# Altium project BK1096.PrjPcb
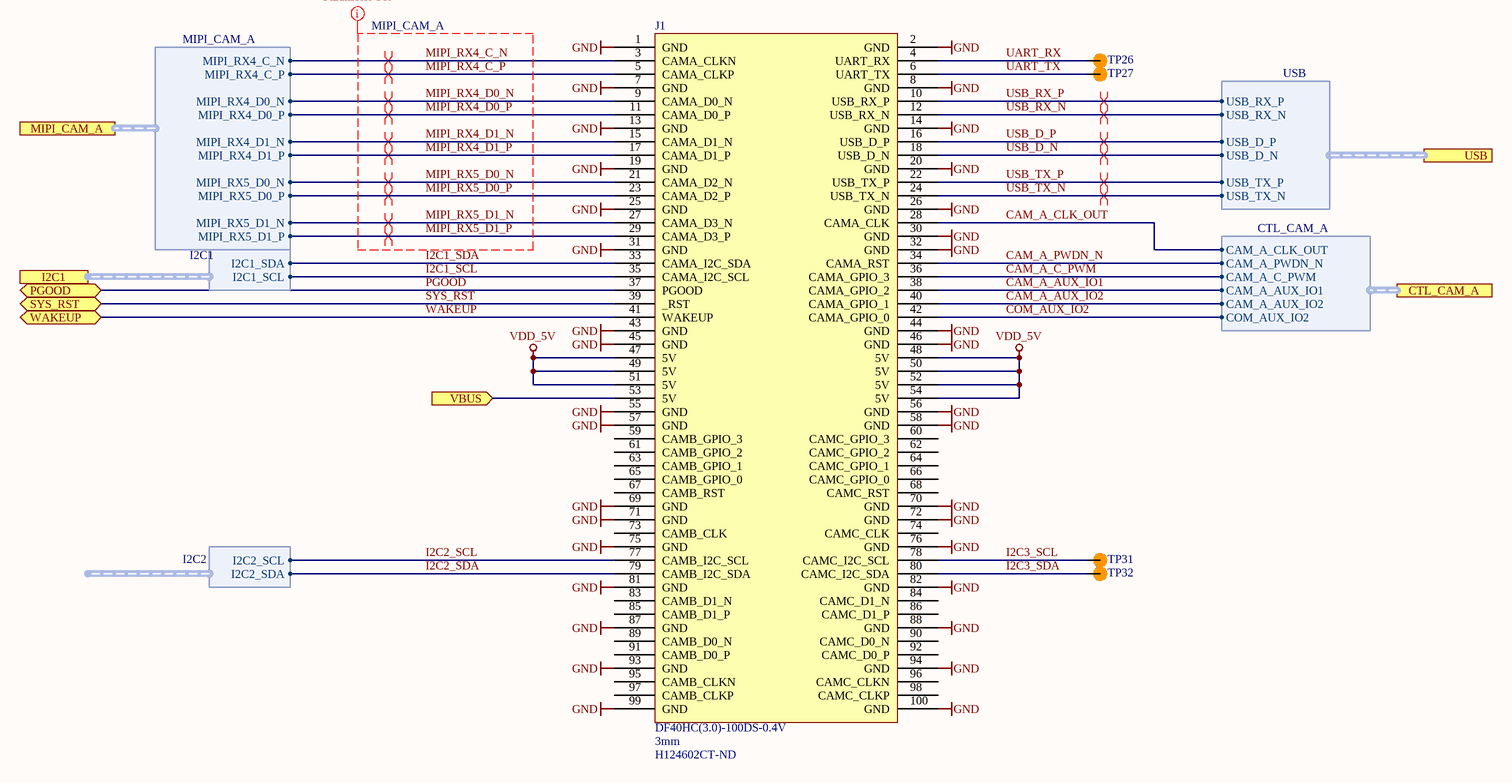
[diagram p0: BK1096_Connector.SchDoc]
document_number: D000BK1096; drawn_by: Blaž Kvas; project_title: BK1096; revision: R0M0E0
2 sheets, 37 parts. Net scope: flat (ports and power ports of the same name join across sheets).
Board file: BK1096.PcbDoc
Sheets:
  BK1096_Connector.SchDoc
  BK1096_Power_Supply.SchDoc

## Sheet BK1096_Connector.SchDoc: =project_title
size Tabloid; CompanyName: Luxonis Holding; DrawnBy: Blaž Kvas; Organization: Luxonis Holding; Address1: 1925 Harmony Park Drive; Address2: Westminster, CO; Address3: 80234; Address4: United States; DocumentNumber: D000BK1096; Revision: R0M0E0; SheetNumber: 2; SheetTotal: 5

### Parts
J1  DF40HC(3.0)-100DS-0.4V  Mated Stacking Heights: 3mm  Supplier Part Number 1: H124602CT-ND  [DF40HC-3.0-100DS-0.4V]
TP26  TP_SMD  [TP_0.75MM_SMD_NO-SILK]  (value not drawn)  (no BOM)
TP27  TP_SMD  [TP_0.75MM_SMD_NO-SILK]  (value not drawn)  (no BOM)
TP31  TP_SMD  [TP_0.75MM_SMD_NO-SILK]  (value not drawn)  (no BOM)
TP32  TP_SMD  [TP_0.75MM_SMD_NO-SILK]  (value not drawn)  (no BOM)

### Ports
CTL_CAM_A (harness CTL_CAM_A), I2C1 (harness I2C1), MIPI_CAM_A (harness MIPI_CAM_A), PGOOD (bidir), SYS_RST (bidir), USB (harness USB), VBUS (in), WAKEUP (bidir)

### Harnesses
MIPI_CAM_A: MIPI_RX4_C_P, MIPI_RX4_C_N, MIPI_RX4_D0_P, MIPI_RX4_D0_N, MIPI_RX4_D1_P, MIPI_RX4_D1_N, MIPI_RX5_D0_P, MIPI_RX5_D0_N, MIPI_RX5_D1_P, MIPI_RX5_D1_N
I2C2: I2C2_SDA, I2C2_SCL
I2C1: I2C1_SDA, I2C1_SCL
USB: USB_D_P, USB_D_N, USB_TX_N, USB_TX_P, USB_RX_N, USB_RX_P
CTL_CAM_A: CAM_A_C_PWM, CAM_A_AUX_IO1, CAM_A_AUX_IO2, COM_AUX_IO2, CAM_A_PWDN_N, CAM_A_CLK_OUT

### Nets
GND: J1.1(GND) J1.2(GND) J1.7(GND) J1.8(GND) J1.13(GND) J1.14(GND) J1.19(GND) J1.20(GND) J1.25(GND) J1.26(GND) J1.30(GND) J1.31(GND) J1.32(GND) J1.43(GND) J1.44(GND) J1.45(GND) J1.46(GND) J1.55(GND) J1.56(GND) J1.57(GND) J1.58(GND) J1.69(GND) J1.70(GND) J1.71(GND) J1.72(GND) J1.75(GND) J1.76(GND) J1.81(GND) J1.82(GND) J1.87(GND) J1.88(GND) J1.93(GND) J1.94(GND) J1.99(GND) J1.100(GND)
VDD_5V: J1.47(5V) J1.48(5V) J1.49(5V) J1.50(5V) J1.51(5V) J1.52(5V) J1.54(5V)
CAM_A_AUX_IO1: J1.38(CAMA_GPIO_2) ; port CTL_CAM_A.CAM_A_AUX_IO1
CAM_A_AUX_IO2: J1.40(CAMA_GPIO_1) ; port CTL_CAM_A.CAM_A_AUX_IO2
CAM_A_C_PWM: J1.36(CAMA_GPIO_3) ; port CTL_CAM_A.CAM_A_C_PWM
CAM_A_CLK_OUT: J1.28(CAMA_CLK) ; port CTL_CAM_A.CAM_A_CLK_OUT
CAM_A_PWDN_N: J1.34(CAMA_RST) ; port CTL_CAM_A.CAM_A_PWDN_N
COM_AUX_IO2: J1.42(CAMA_GPIO_0) ; port CTL_CAM_A.COM_AUX_IO2
I2C1_SCL: J1.35(CAMA_I2C_SCL) ; port I2C1.I2C1_SCL
I2C1_SDA: J1.33(CAMA_I2C_SDA) ; port I2C1.I2C1_SDA
I2C2_SCL: J1.77(CAMB_I2C_SCL) ; harness I2C2.I2C2_SCL
I2C2_SDA: J1.79(CAMB_I2C_SDA) ; harness I2C2.I2C2_SDA
I2C3_SCL: J1.78(CAMC_I2C_SCL) TP31.1
I2C3_SDA: J1.80(CAMC_I2C_SDA) TP32.1
MIPI_RX4_C_N: J1.3(CAMA_CLKN) ; port MIPI_CAM_A.MIPI_RX4_C_N
MIPI_RX4_C_P: J1.5(CAMA_CLKP) ; port MIPI_CAM_A.MIPI_RX4_C_P
MIPI_RX4_D0_N: J1.9(CAMA_D0_N) ; port MIPI_CAM_A.MIPI_RX4_D0_N
MIPI_RX4_D0_P: J1.11(CAMA_D0_P) ; port MIPI_CAM_A.MIPI_RX4_D0_P
MIPI_RX4_D1_N: J1.15(CAMA_D1_N) ; port MIPI_CAM_A.MIPI_RX4_D1_N
MIPI_RX4_D1_P: J1.17(CAMA_D1_P) ; port MIPI_CAM_A.MIPI_RX4_D1_P
MIPI_RX5_D0_N: J1.21(CAMA_D2_N) ; port MIPI_CAM_A.MIPI_RX5_D0_N
MIPI_RX5_D0_P: J1.23(CAMA_D2_P) ; port MIPI_CAM_A.MIPI_RX5_D0_P
MIPI_RX5_D1_N: J1.27(CAMA_D3_N) ; port MIPI_CAM_A.MIPI_RX5_D1_N
MIPI_RX5_D1_P: J1.29(CAMA_D3_P) ; port MIPI_CAM_A.MIPI_RX5_D1_P
PGOOD: J1.37(PGOOD) ; port PGOOD
SYS_RST: J1.39(_RST) ; port SYS_RST
UART_RX: J1.4(UART_RX) TP26.1
UART_TX: J1.6(UART_TX) TP27.1
USB_D_N: J1.18(USB_D_N) ; port USB.USB_D_N
USB_D_P: J1.16(USB_D_P) ; port USB.USB_D_P
USB_RX_N: J1.12(USB_RX_N) ; port USB.USB_RX_N
USB_RX_P: J1.10(USB_RX_P) ; port USB.USB_RX_P
USB_TX_N: J1.24(USB_TX_N) ; port USB.USB_TX_N
USB_TX_P: J1.22(USB_TX_P) ; port USB.USB_TX_P
WAKEUP: J1.41(WAKEUP) ; port WAKEUP
NetJ1_53: J1.53(5V) ; port VBUS

Not connected (* = marked no-connect by the designer): J1 59(CAMB_GPIO_3) 60(CAMC_GPIO_3) 61(CAMB_GPIO_2) 62(CAMC_GPIO_2) 63(CAMB_GPIO_1) 64(CAMC_GPIO_1) 65(CAMB_GPIO_0) 66(CAMC_GPIO_0) 67(CAMB_RST) 68(CAMC_RST) 73(CAMB_CLK) 74(CAMC_CLK) 83(CAMB_D1_N) 84(CAMC_D1_N) 85(CAMB_D1_P) 86(CAMC_D1_P) 89(CAMB_D0_N) 90(CAMC_D0_N) 91(CAMB_D0_P) 92(CAMC_D0_P) 95(CAMB_CLKN) 96(CAMC_CLKN) 97(CAMB_CLKP) 98(CAMC_CLKP)

### Layout directives
differential pair; differential pair class USB_D: USB_D_N, USB_D_P
differential pair; differential pair class USB_RxTX: USB_RX_N, USB_RX_P, USB_TX_N, USB_TX_P
differential pair; differential pair class MIPI_CAMS: MIPI_RX4_C_N, MIPI_RX4_C_P, MIPI_RX4_D0_N, MIPI_RX4_D0_P, MIPI_RX4_D1_N, MIPI_RX4_D1_P, MIPI_RX5_D0_N, MIPI_RX5_D0_P, MIPI_RX5_D1_N, MIPI_RX5_D1_P
net class MIPI_CAM_A; rule Matched Net Lengths [Tolerance = 5mil]: MIPI_RX4_C_N, MIPI_RX4_C_P, MIPI_RX4_D0_N, MIPI_RX4_D0_P, MIPI_RX4_D1_N, MIPI_RX4_D1_P, MIPI_RX5_D0_N, MIPI_RX5_D0_P, MIPI_RX5_D1_N, MIPI_RX5_D1_P

### Notes on the sheet
- Title
- Size:
- Date:
- Tabloid
- Number:
- Time:
- Revision:
- Sheet
- of
- Drawn by:

### Library data of the parts
J1 = DF40HC(3.0)-100DS-0.4V: CONN RCPT 100POS 0.4MM SMD GOLD; Manufacturer 1: Hirose; Manufacturer Part Number 1: DF40HC(3.0)-100DS-0.4V(58; Connector Type: Receptacle; Number of Positions: 100; Pitch: 0.016inch; Supplier 1: Digi-Key; Stock 1: 867; Pricing 1: 1=2.75000, 10=2.64000, 25=2.42000, 50=2.31000, 100=2.20000, 250=1.92500, 500=1.87000 (USD); RoHS: Yes; Mount: Surface Mount; Contact Plating: Gold; Packaging: Tape and Reel; Number of Rows: 2; Package Quantity: 1000; Lead Free: Lead Free; ComponentLink1URL: https://datasheet.ciiva.com/46636/ed-df40-20140305-46636517.pdf?src-supplier=Digi-Key; ComponentLink1Description: https://datasheet.ciiva.com/46636/ed-df40-20140305-46636517.pdf?src-supplier=Digi-Key; ComponentLink2URL: https://datasheet.ciiva.com/18562/ed-df40-20140305-18562189.pdf?src-supplier=Digi-Key; ComponentLink2Description: https://datasheet.ciiva.com/18562/ed-df40-20140305-18562189.pdf?src-supplier=Digi-Key
TP26 TP27 TP31 TP32 = TP_SMD: circular pad test point, SMD

## Sheet BK1096_Power_Supply.SchDoc: =project_title
size Tabloid; PageSetup: Record=PageOptions|CenterHorizontal=True|CenterVertical=True|PrintScale=0.73|XCorrection=1.00|YCorrection=1.00|PrintKind=0|BorderSize=5000000|LeftOffset=0|BottomOffset=0|Orientation=2|PaperLength=1000|PaperWidth=1000|Scale=100|PaperSource=7|PrintQuality=-4|MediaType=1|DitherType=10|PaperKind=A4|PrintScaleMode=1; CompanyName: Luxonis Holding; DrawnBy: Blaž Kvas; Organization: Luxonis Holding; Address1: 1925 Harmony Park Drive; Address2: Westminster, CO; Address3: 80234; Address4: United States; DocumentNumber: D000BK1096; Revision: R0M0E0; SheetNumber: 4; SheetTotal: 5
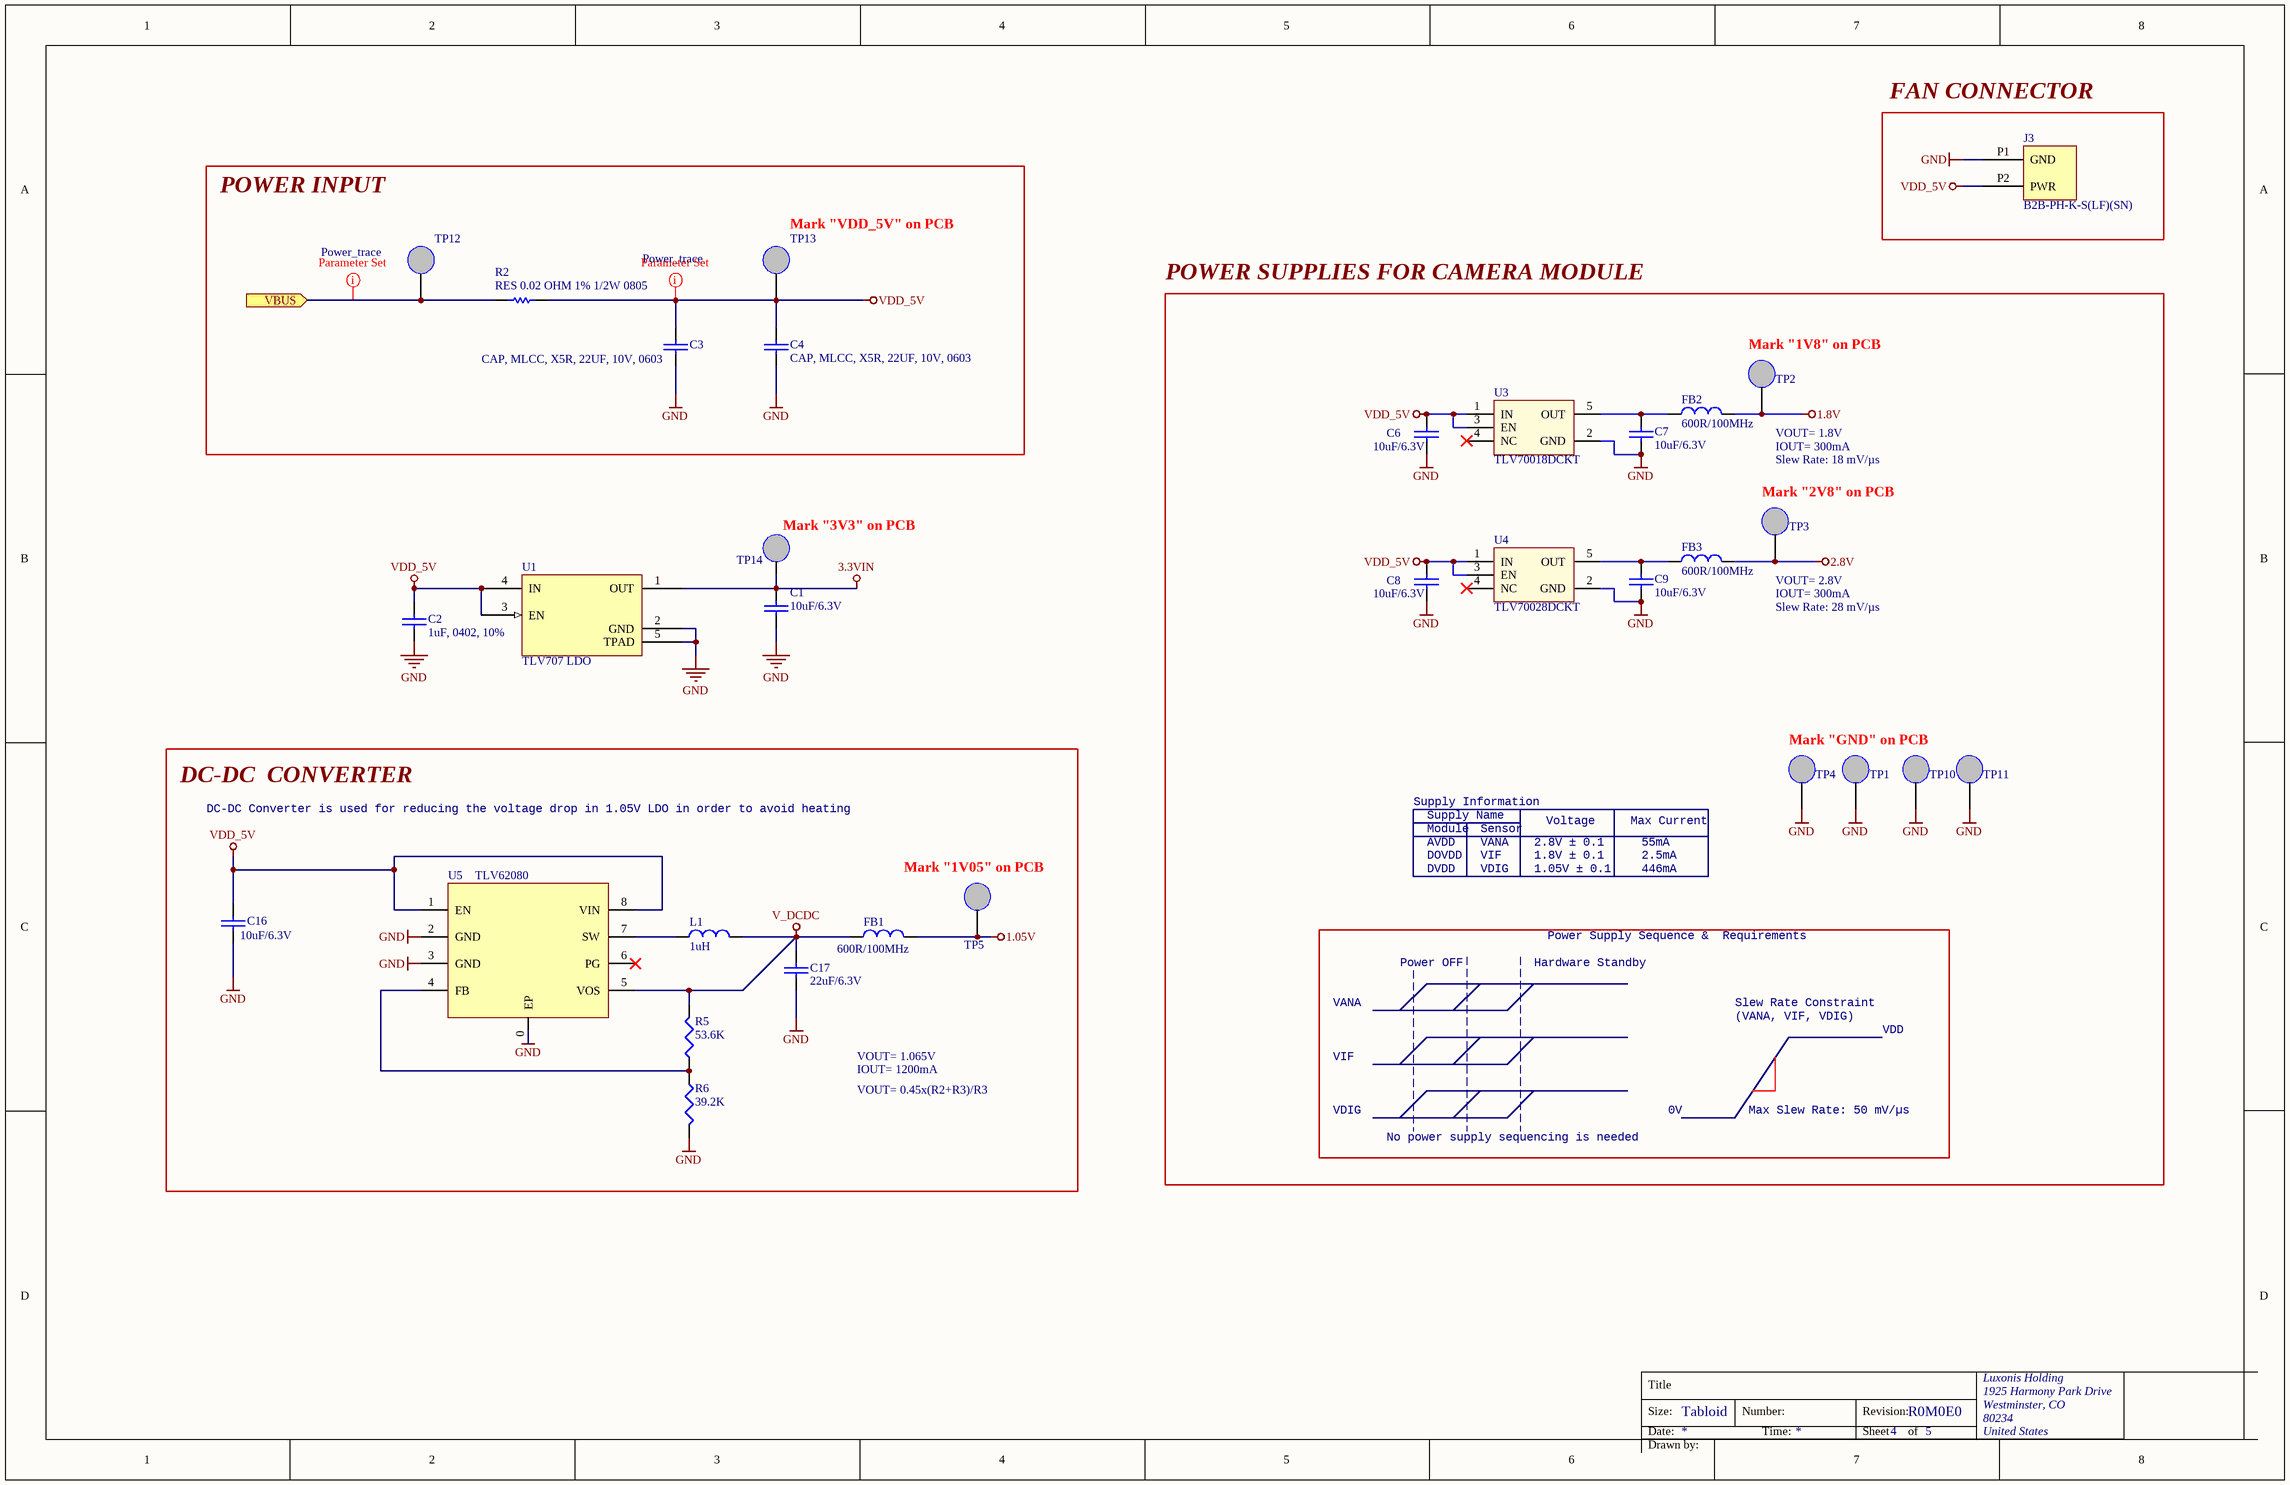
[diagram p1: BK1096_Power_Supply.SchDoc]

### Parts
C1  10uF/6.3V  [CAPC0402(1005)70_N]
C2  1uF, 0402, 10%  [CAPC0402(1005)70_N]
C3  CAP, MLCC, X5R, 22UF, 10V, 0603  [CAPC0603(1608)100_N]
C4  CAP, MLCC, X5R, 22UF, 10V, 0603  [CAPC0603(1608)100_N]
C6  10uF/6.3V  [0603]
C7  10uF/6.3V  [0603]
C8  10uF/6.3V  [0603]
C9  10uF/6.3V  [0603]
C16  10uF/6.3V  [0805]
C17  22uF/6.3V  [0805]
FB1  600R/100MHz  [0805]
FB2  600R/100MHz  [0805]
FB3  600R/100MHz  [0805]
J3  B2B-PH-K-S(LF)(SN)  [*JST_B2B-PH-K-S(LF)(SN)]
L1  1uH  [744029001]
R2  RES 0.02 OHM 1% 1/2W 0805  [RESC0805(2012)_N]
R5  53.6K  [0603]
R6  39.2K  [0603]
TP1  TP NM  [TP_SMD]  (value not drawn)  (no BOM)
TP2  TP NM  [TP_SMD]  (value not drawn)  (no BOM)
TP3  TP NM  [TP_SMD]  (value not drawn)  (no BOM)
TP4  TP NM  [TP_SMD]  (value not drawn)  (no BOM)
TP5  TP NM  [TP_SMD]  (value not drawn)  (no BOM)
TP10  TP NM  [TP_SMD]  (value not drawn)  (no BOM)
TP11  TP NM  [TP_SMD]  (value not drawn)  (no BOM)
TP12  TP NM  [TP_SMD]  (value not drawn)  (no BOM)
TP13  TP NM  [TP_SMD]  (value not drawn)  (no BOM)
TP14  TP NM  [TP_SMD]  (value not drawn)  (no BOM)
U1  TLV707 LDO  [DFN65P100X40-4L]
U3  TLV70018DCKT  [SC70-5]
U4  TLV70028DCKT  [SC70-5]
U5  TLV62080  [WSON-8]

### Blocks framed on the sheet
FAN CONNECTOR: J3
POWER INPUT: C3 C4 R2 TP12 TP13
POWER SUPPLIES FOR CAMERA MODULE: C6-C9 FB2 FB3 TP1-TP4 TP10 TP11 U3 U4
DC-DC  CONVERTER: C16 C17 FB1 L1 R5 R6 TP5 U5

### Ports
VBUS (in)

### Nets
1.05V: FB1.2 TP5.1
1.8V: FB2.2 TP2.1
2.8V: FB3.2 TP3.1
3.3VIN: C1.2 TP14.1 U1.1(OUT)
GND: C1.1 C2.2 C3.2 C4.2 C6.2 C7.2 C8.2 C9.2 C16.2 C17.2 J3.P1(GND) R6.2 TP1.1 TP4.1 TP10.1 TP11.1 U1.2(GND) U1.5(TPAD) U3.2(GND) U4.2(GND) U5.0(EP) U5.2(GND) U5.3(GND)
V_DCDC: C17.1 FB1.1 L1.1 R5.2 U5.5(VOS)
VDD_5V: C2.1 C3.1 C4.1 C6.1 C8.1 C16.1 J3.P2(PWR) R2.1 TP13.1 U1.3(EN) U1.4(IN) U3.1(IN) U3.3(EN) U4.1(IN) U4.3(EN) U5.1(EN) U5.8(VIN)
NetC7_1: C7.1 FB2.1 U3.5(OUT)
NetC9_1: C9.1 FB3.1 U4.5(OUT)
NetJ1_53: R2.2 TP12.1 ; port VBUS
NetL1_2: L1.2 U5.7(SW)
NetR5_1: R5.1 R6.1 U5.4(FB)

Not connected (* = marked no-connect by the designer): U3 4(NC)*; U4 4(NC)*; U5 6(PG)*

### Layout directives
net class Power_trace: NetJ1_53, VDD_5V

### Notes on the sheet
- (near TP13) Mark "VDD_5V" on PCB
- (near TP2) Mark "1V8" on PCB
- VOUT= 1.8V
- (near TP3) Mark "2V8" on PCB
- IOUT= 300mA
- Slew Rate: 18 mV/µs
- (near TP14) Mark "3V3" on PCB
- VOUT= 2.8V
- Slew Rate: 28 mV/µs
- Mark "GND" on PCB
- DC-DC Converter is used for reducing the voltage drop in 1.05V LDO in order to avoid heating
- Supply Information
- Supply Name
- Module
- Sensor
- Voltage
- Max Current
- (near TP5) Mark "1V05" on PCB
- AVDD
- DOVDD
- DVDD
- VANA
- VIF
- VDIG
- 2.8V ± 0.1
- 1.8V ± 0.1
- 1.05V ± 0.1
- 55mA
- 2.5mA
- 446mA
- Power OFF
- Hardware Standby
- Power Supply Sequence &  Requirements
- Slew Rate Constraint
- (VANA, VIF, VDIG)
- VDD
- VOUT= 1.065V
- IOUT= 1200mA
- VOUT= 0.45x(R2+R3)/R3
- No power supply sequencing is needed
- 0V
- Max Slew Rate: 50 mV/µs
- Title
- Size:
- Date:
- Tabloid
- Number:
- Time:
- Revision:
- Sheet
- of
- Drawn by:

### Library data of the parts
C1 = CAP: SMD Multilayer Ceramic Capacitor, 0402 [1005 Metric], 10 µF, 6.3 V, ± 20%, X5R; E - MFG: MuRata; F - MFG P/N: GRM155R60J106ME44D; D - my Footprint: CAPC0402(1005)70_N
C2 = CL05A105KP5NNNC: Cap Ceramic 1uF 10V X5R 10% SMD 0402 85C Paper T/R; Manufacturer: Samsung; Supplier 1: Digi-Key; Manufacturer Part Number: CL05A105KP5NNNC; Stock 1: 13690251; Pricing 1: 1 = 0.10000, 10 = 0.04200, 100 = 0.01880, 500 = 0.01340, 1000 = 0.01053, 2500 = 0.00958, 5000 = 0.00881 (USD); RoHS: Yes; Mount: Surface Mount; Case/Package: 0402; Case Code (Metric): 1005; Case Code (Imperial): 0402; Material: Ceramic; Contact Plating: Tin; Min Operating Temperature: -55°C; Max Operating Temperature: 85°C; Capacitance: 1uF; Tolerance: 10%; Packaging: Tape and Reel; Voltage Rating: 10V; Dielectric: X5R; Package Quantity: 1; Length: 1mm; Height: 0.5mm; Width: 0.02inch; Thickness: 0.022inch; Depth: 0.5mm; Radiation Hardening: No; ComponentLink1URL: https://datasheet.ciiva.com/15195/getdatasheetpartid-358390-15195630.pdf?src-supplier=Verical; ComponentLink1Description: https://datasheet.ciiva.com/15195/getdatasheetpartid-358390-15195630.pdf?src-supplier=Verical; ComponentLink2URL: https://datasheet.ciiva.com/29198/459159-da-01-en-vs-kondensator-0402-29198341.pdf?src-supplier=Conrad; ComponentLink2Description: https://datasheet.ciiva.com/29198/459159-da-01-en-vs-kondensator-0402-29198341.pdf?src-supplier=Conrad
C3 C4 = GRM188R61A226ME15D: Manufacturer 1: *
C6-C9 = CAP: SMD Multilayer Ceramic Capacitor, 0603 [1608 Metric], 10 µF, 6.3 V, ± 20%, X5R; MAN: Yageo(PHYCOM); MAN PN: CC0603MRX5R5BB106; ICCO PN: MV122009; DIST: Farnell; DIST PN: 1458902
C16 = CAP: CERAMIC CAPACITOR, 10UF, 6.3V, X5R, 20%, 0805; MAN: TAIYO YUDEN; MAN PN: JMK212BJ106MG-T; ICCO PN: M1V10010; DIST PN: 2372273; DIST: Farnell
C17 = CAP: SMD Multilayer Ceramic Capacitor, 0805 [2012 Metric], 22 µF, 6.3 V, ± 10%, X5R; MAN: TAIYO YUDEN; MAN PN: JMK212BJ226KG-T; ICCO PN: MV122020; DIST PN: 2113069; DIST: Farnell
FB1-FB3 = INDUCTANCE1: Ferrite Bead, 600 ohm, 0805 [2012 Metric], 2 A, 0.1 ohm, ± 25%; MAN: FAIR-RITE; MAN PN: 2508056017Y2; ICCO PN: MV142024; DIST: Farnell; DIST PN: 1838838RL
J3 = B2B-PH-K-S(LF)(SN): CONN HEADER VERT 2POS 2MM; Manufacturer: JST; Number of Positions: 2; Connector Type: Male Pin; Current Rating: 2A; Gender: Male; Contact Resistance: 20mR; Insulation Resistance: 1MR; Voltage Rating: 100V; Supplier 1: Digi-Key; Manufacturer Part Number: B2B-PH-K-S(LF)(SN); Stock 1: 216199; Pricing 1: 1 = 0.170000, 10 = 0.162000, 100 = 0.100200, 500 = 0.082880, 1000 = 0.072520, 5000 = 0.062160, 10000 = 0.060440 (USD); RoHS: Yes; Mount: Through Hole; Number of Pins: 2; Contact Plating: Tin; Color: Natural; Contact Material: Brass; Housing Material: Polyamide; Housing Color: White; Min Operating Temperature: -25°C; Max Operating Temperature: 85°C; Number of Rows: 1; Packaging: Bulk; Termination: Solder; Fastening Type: Detent; Number of Poles: 2; Number of Contacts: 2; Orientation: Straight; Max Current Rating: 2A; Max Voltage Rating (AC): 100V; Voltage Rating (AC): 100V; Working Voltage: 100V; Max Voltage Rating (DC): 100V; Length: 5.9mm; Height: 9.4mm; Pitch: 2mm; Width: 4.5mm; Contact Mating Length: 0.13inch; Depth: 4.5mm; Lead Pitch: 2mm; Lead Free: Lead Free; REACH SVHC: No SVHC; ComponentLink1URL: https://datasheet.ciiva.com/6747/80560-6747392.pdf?src-supplier=Newark; ComponentLink1Description: https://datasheet.ciiva.com/6747/80560-6747392.pdf?src-supplier=Newark; ComponentLink2URL: https://datasheet.ciiva.com/11746/0900766b8082f551-11746676.pdf?src-supplier=RSComponents; ComponentLink2Description: https://datasheet.ciiva.com/11746/0900766b8082f551-11746676.pdf?src-supplier=RSComponents; ComponentLink3URL: https://datasheet.ciiva.com/8052/80560-8052022.pdf?src-supplier=Element14; ComponentLink3Description: https://datasheet.ciiva.com/8052/80560-8052022.pdf?src-supplier=Element14; ComponentLink4URL: https://datasheet.ciiva.com/712/eph-712442.pdf?src-supplier=Digi-Key; ComponentLink4Description: https://datasheet.ciiva.com/712/eph-712442.pdf?src-supplier=Digi-Key; ComponentLink5URL: https://datasheet.ciiva.com/16422/b2b-ph-k-slfsn-16422715.pdf?src-supplier=Future+Electronics; ComponentLink5Description: https://datasheet.ciiva.com/16422/b2b-ph-k-slfsn-16422715.pdf?src-supplier=Future+Electronics; Supplier Part Number 1: 455-1704-ND
L1 = INDUCTANCE1_1: FIXED IND 1UH 2.2A 55 MOHM SMD; MAN: Wurth; ICCO PN: MV249002; DIST: Farnell; DIST PN: 1635825; MAN PN: 744029001
R2 = D-100-0004
R5 = RES1: RES SMD 53.6K OHM 1% 1/10W 0603; MAN PN: CR0603-FX-5362ELF; MAN: Bourns Inc.; DIST: Digi-Key; DIST PN: CR0603-FX-5362ELFCT-ND
R6 = RES1: SMD Chip Resistor, Anti-Surge, 39.2 kohm, 150 V, 0603 [1608 Metric], 250 mW, ± 1%; MAN PN: ERJPA3F3922V; MAN: Panasonic; ICCO PN: MV249003; DIST: Farnell; DIST PN: 2562012RL
TP1-TP5 TP10-TP14 = TP: TEST POIN; MAN: SMD TESTPOINT; MAN PN: SMD TESTPOINT
U1 = TLV707: IC REG LDO 1V 0.2A 4X2SON; Manufacturer: Texas Instruments; Manufacturer Part Number: TLV70710DQNR; Output Current: 200mA; Number of Regulators: 1; Min Current Limit: 240mA; Quiescent Current: 25uA; Dropout Voltage: 250mV; Supplier 1: Digi-Key; Stock 1: 4380; Pricing 1: 1 = 0.46000, 10 = 0.37300, 100 = 0.25380, 500 = 0.19034, 1000 = 0.14276 (USD); RoHS: Yes; Mount: Surface Mount; Min Operating Temperature: -40°C; Max Operating Temperature: 125°C; Packaging: Tape and Reel; Package Quantity: 3000; Output Voltage: 1V; Lead Free: Lead Free; ComponentLink1URL: http://www.ti.com/lit/gpn/tlv707?src-supplier=Mouser; ComponentLink1Description: http://www.ti.com/lit/gpn/tlv707?src-supplier=Mouser; ComponentLink2URL: http://www.ti.com/lit/ds/symlink/tlv707.pdf?src-supplier=Digi-Key; ComponentLink2Description: http://www.ti.com/lit/ds/symlink/tlv707.pdf?src-supplier=Digi-Key
U3 = TLV70018DCKT: LDO, 200MA, 1.8V, 5SC70; MAN: TI; DIST PN: 1778221; DIST: Farnell; ICCO PN: MV198003; MAN PN: TLV70018DCKT
U4 = TLV70028DCKT: LDO, 200MA, 2.8V, 5SC70; MAN: TI; DIST PN: 1778222; DIST: Farnell; ICCO PN: MV200002; MAN PN: TLV70028DCKT
U5 = TLV62080: IC REG BUCK ADJ 1.2A SYNC 8WSON; ICCO PN: MV249006; MAN: TI; MAN PN: TLV62080DSGT; DIST: Mouser; DIST PN: 595-TLV62080DSGT

## Nets that join several sheets
GND: BK1096_Connector (35 pins), BK1096_Power_Supply (23 pins)
VDD_5V: BK1096_Connector (7 pins), BK1096_Power_Supply (17 pins)
NetJ1_53: BK1096_Connector (J1.53), BK1096_Power_Supply (R2.2 TP12.1)

## Assembly variants
Production: not fitted D27 D28 D29 D36 RZ28 RZ29